# Altium schematic sheet Output Drivers1.SchDoc
size A3; SheetNumber: 6; SheetTotal: 6
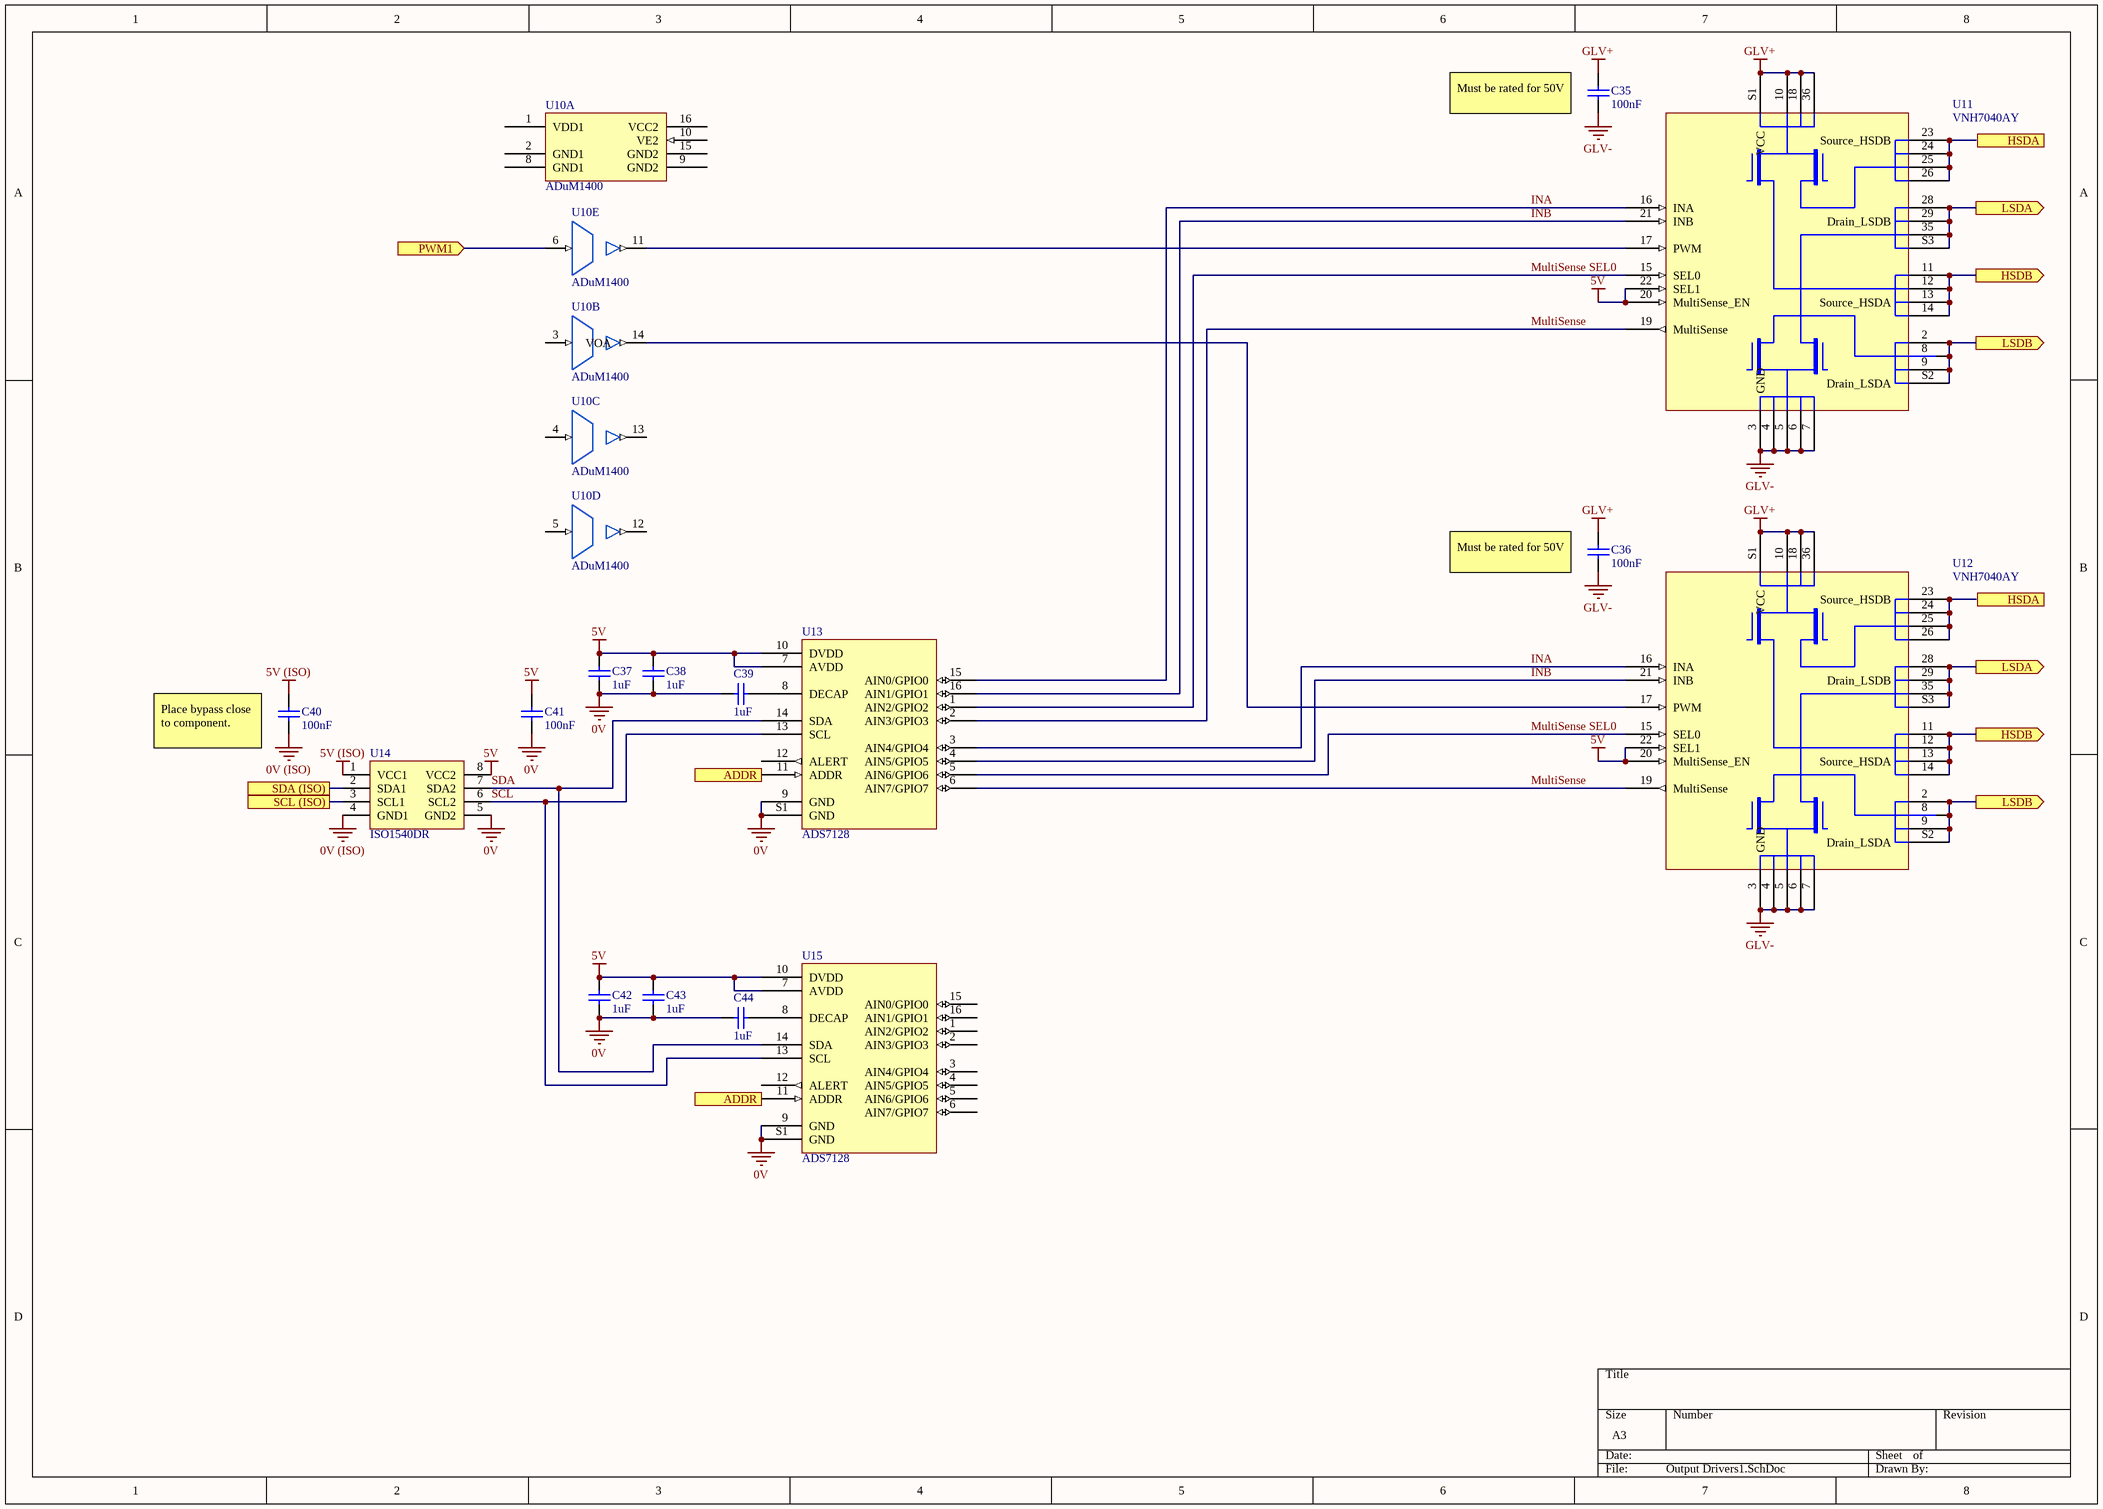
[diagram p0: Output Drivers1.SchDoc]

## Parts
C35  100nF  [0805]
C36  100nF  [0805]
C37  1uF  [0805]
C38  1uF  [0805]
C39  1uF  [0805]
C40  100nF  [0805]
C41  100nF  [0805]
C42  1uF  [0805]
C43  1uF  [0805]
C44  1uF  [0805]
U10  ADuM1400  [AD 16-SOIC]  (parts A,B,C,D,E of 5)
U11  VNH7040AY  [ST PowerSSO-36]
U12  VNH7040AY  [ST PowerSSO-36]
U13  ADS7128  [TI 16-WQFN]
U14  ISO1540DR  [TI 8-SOIC]
U15  ADS7128  [TI 16-WQFN]

## Ports
ADDR (in), HSDA (out), HSDB (out), LSDA (out), LSDB (out), PWM1 (in), SCL (ISO), SDA (ISO)

## Nets
0V: C37.1 C38.1 C39.2 C41.1 C42.1 C43.1 C44.2 U13.9(GND) U13.S1(GND) U14.5(GND2) U15.9(GND) U15.S1(GND)
0V (ISO): C40.1 U14.4(GND1)
5V: C37.2 C38.2 C41.2 C42.2 C43.2 U11.20(MultiSense_EN) U11.22(SEL1) U12.20(MultiSense_EN) U12.22(SEL1) U13.7(AVDD) U13.10(DVDD) U14.8(VCC2) U15.7(AVDD) U15.10(DVDD)
5V (ISO): C40.2 U14.1(VCC1)
GLV+: C35.2 C36.2 U11.10(VCC) U11.18(VCC) U11.36(VCC) U11.S1(VCC) U12.10(VCC) U12.18(VCC) U12.36(VCC) U12.S1(VCC)
GLV-: C35.1 C36.1 U11.3(GND) U11.4(GND) U11.5(GND) U11.6(GND) U11.7(GND) U12.3(GND) U12.4(GND) U12.5(GND) U12.6(GND) U12.7(GND)
ADDR: U13.11(ADDR) U15.11(ADDR) ; port ADDR
HSDB: U11.11(Source_HSDA) U11.12(Source_HSDA) U11.13(Source_HSDA) U11.14(Source_HSDA) U12.11(Source_HSDA) U12.12(Source_HSDA) U12.13(Source_HSDA) U12.14(Source_HSDA) ; port HSDB
INA: U11.16(INA) U12.16(INA) U13.3(AIN4/GPIO4) U13.15(AIN0/GPIO0)
INB: U11.21(INB) U12.21(INB) U13.4(AIN5/GPIO5) U13.16(AIN1/GPIO1)
LSDA: U11.28(Drain_LSDB) U11.29(Drain_LSDB) U11.35(Drain_LSDB) U11.S3(Drain_LSDB) U12.28(Drain_LSDB) U12.29(Drain_LSDB) U12.35(Drain_LSDB) U12.S3(Drain_LSDB) ; port LSDA
LSDB: U11.2(Drain_LSDA) U11.8(Drain_LSDA) U11.9(Drain_LSDA) U11.S2(Drain_LSDA) U12.2(Drain_LSDA) U12.8(Drain_LSDA) U12.9(Drain_LSDA) U12.S2(Drain_LSDA) ; port LSDB
MultiSense: U11.19(MultiSense) U12.19(MultiSense) U13.2(AIN3/GPIO3) U13.6(AIN7/GPIO7)
MultiSense SEL0: U11.15(SEL0) U12.15(SEL0) U13.1(AIN2/GPIO2) U13.5(AIN6/GPIO6)
PWM1: U10.6(VID) ; port PWM1
SCL: U13.13(SCL) U14.6(SCL2) U15.13(SCL)
SCL (ISO): U14.3(SCL1) ; port SCL (ISO)
SDA: U13.14(SDA) U14.7(SDA2) U15.14(SDA)
SDA (ISO): U14.2(SDA1) ; port SDA (ISO)
NetC39_1: C39.1 U13.8(DECAP)
NetC44_1: C44.1 U15.8(DECAP)
NetU10_11: U10.11(VOD) U11.17(PWM)
NetU10_14: U10.14(VOA) U12.17(PWM)
NetU11_23: U11.23(Source_HSDB) U11.24(Source_HSDB) U11.25(Source_HSDB) U11.26(Source_HSDB)
NetU12_23: U12.23(Source_HSDB) U12.24(Source_HSDB) U12.25(Source_HSDB) U12.26(Source_HSDB)

Not connected (* = marked no-connect by the designer): U10 1(VDD1) 2(GND1) 3(VIA) 4(VIB) 5(VIC) 8(GND1) 9(GND2) 10(VE2) 12(VOC) 13(VOB) 15(GND2) 16(VCC2); U13 12(ALERT); U15 1(AIN2/GPIO2) 2(AIN3/GPIO3) 3(AIN4/GPIO4) 4(AIN5/GPIO5) 5(AIN6/GPIO6) 6(AIN7/GPIO7) 12(ALERT) 15(AIN0/GPIO0) 16(AIN1/GPIO1)

## Notes on the sheet
- (near C35) Must be rated for 50V
- (near C36) Must be rated for 50V
- (near C40) Place bypass close to component.

## Library data of the parts
C35 C36 C40 C41 = GCM21BR71E104KA37L: Manufacturer: muRata; Tolerance: 10%; Material: X7R; Rated Voltage: 25V; Part Number: GCM21BR71E104KA37L; Value: 100nF; Digikey Part Number: DO NOT USE FOR NEW DESIGNS
C37-C39 C42-C44 = AC0805KKX7R8BB105: Manufacturer: YAGEO; Tolerance: 10%; Material: X7R; Rated Voltage: 25V; Part Number: AC0805KKX7R8BB105; Value: 1uF; Digikey Part Number: DO NOT USE FOR NEW DESIGNS
U10 = ADuM1400: General Purpose Digital Isolator 2500Vrms 4 Channel 1Mbps 25kV/µs CMTI 16-SOIC (0.295", 7.50mm Width); Manufacturer: Analog Devices; Part Number: ADuM1400; Digikey Part Number: ADUM1400WSRWZ-ND; Digikey Link: https://www.digikey.com/product-detail/en/analog-devices-inc/ADUM1400WSRWZ/ADUM1400WSRWZ-ND/1873713
U11 U12 = VNH7040AY: Motor Driver Power MOSFET PWM PowerSSO-36 TP; Manufacturer: STMicroelectronics; Notes/Alternatives: VNH7070AYTR; Part Number: VNH7040AY; Digikey Part Number: 497-17631-1-ND; Digikey Link: https://www.digikey.com/en/products/detail/stmicroelectronics/VNH7040AYTR/7691019?s=N4IgTCBcDaIG4DsAWB2ADAFjSAugXyA
U13 U15 = ADS7128: 12 Bit Analog to Digital Converter 8 Input 1 SAR 16-WQFN (3x3); Manufacturer: Texas Instruments; Part Number: ADS7128; Digikey Part Number: 296-ADS7128IRTERCT-ND; Digikey Link: https://www.digikey.com/en/products/detail/texas-instruments/ADS7128IRTER/12696006?s=N4IgTCBcDaIIYBMDOB2AjGAHCAugXyA
U14 = ISO1540DR: I2C Digital Isolator (Multichannel); Manufacturer: Texas Instruments; Part Number: ISO1540DR; Digikey Part Number: 296-34871-1-ND; Digikey Link: https://www.digikey.com/product-detail/en/texas-instruments/ISO1540DR/296-34871-1-ND/3587214